# Altium schematic sheet SSRT Tronics.SchDoc
size A4; Organization: Altium Limited; Address1: L3, 12a Rodborough Rd; Address2: Frenchs Forest; Address3: NSW; Address4: Australia 2086; SheetNumber: 1; SheetTotal: 2
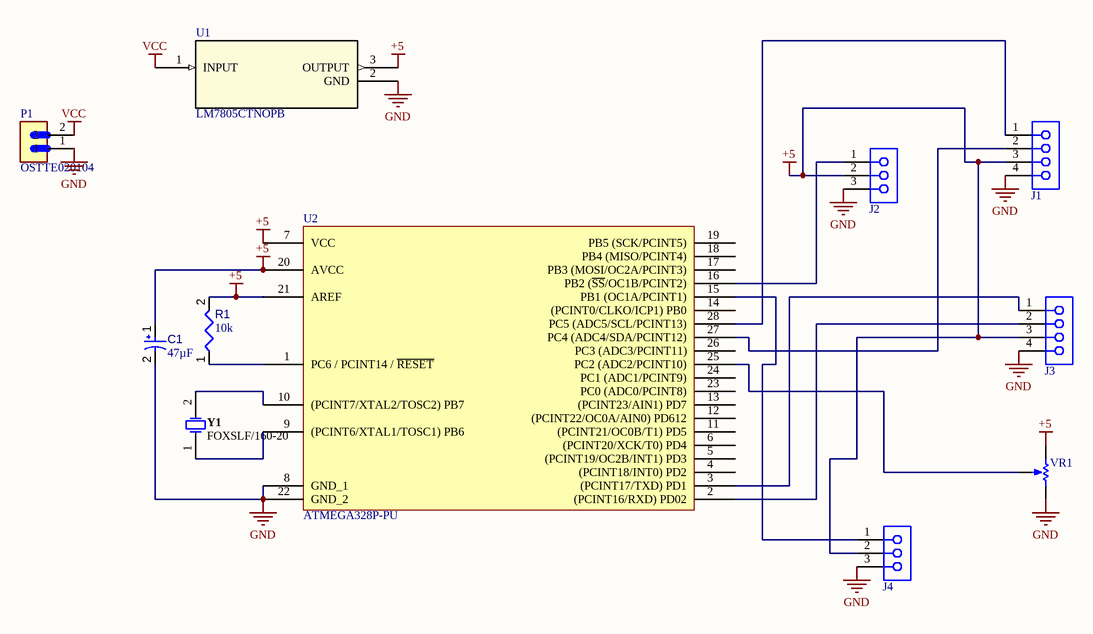
[diagram p0: SSRT Tronics.SchDoc]

## Parts
C1  value 47µF  [CAPPR55-250-1120X630X1220]  (hidden comment: ECA-1HM470)
J1  61300411821  [61300411821]  (value not drawn)
J2  61300311821  [61300311821]  (value not drawn)
J3  61300411821  [61300411821]  (value not drawn)
J4  61300311821  [61300311821]  (value not drawn)
P1  OSTTE020104  [OST_OSTTE020104]
R1  value 10k  [RESA60-630X240]  (hidden comment: MFR-25FBF52-10K)
U1  LM7805CTNOPB  [NDE3_TEX]
U2  ATMEGA328P-PU  [27_DIP_7.62mm]
VR1  3296W-1-103LF  [BOUR-3296W]  (value not drawn)
Y1  FOXSLF/160-20  [FOX-FOXSLF160-20]

## Nets
+5: C1.1 J1.3 J2.2 J3.3 J4.2 R1.2 U1.3(OUTPUT) U2.7(VCC) U2.20(AVCC) U2.21(AREF) VR1.1(CCW)
GND: C1.2 J1.4 J2.3 J3.4 J4.3 P1.1 U1.2(GND) U2.8(GND_1) U2.22(GND_2) VR1.3(CW)
VCC: P1.2 U1.1(INPUT)
NetJ1_1: J1.1 U2.28(PC5_(ADC5/SCL/PCINT13))
NetJ1_2: J1.2 U2.27(PC4_(ADC4/SDA/PCINT12))
NetJ2_1: J2.1 U2.16(PB2_(~{SS}/OC1B/PCINT2))
NetJ3_1: J3.1 U2.3((PCINT17/TXD)_PD1)
NetJ3_2: J3.2 U2.2((PCINT16/RXD)_PD02)
NetJ4_1: J4.1 U2.15(PB1_(OC1A/PCINT1))
NetR1_1: R1.1 U2.1(PC6_/_PCINT14_/_~{RESET})
NetU2_9: U2.9((PCINT6/XTAL1/TOSC1)_PB6) Y1.1
NetU2_10: U2.10((PCINT7/XTAL2/TOSC2)_PB7) Y1.2
NetU2_25: U2.25(PC2_(ADC2/PCINT10)) VR1.2(S)

Not connected (* = marked no-connect by the designer): U2 4((PCINT18/INT0)_PD2) 5((PCINT19/OC2B/INT1)_PD3) 6((PCINT20/XCK/T0)_PD4) 11((PCINT21/OC0B/T1)_PD5) 12((PCINT22/OC0A/AIN0)_PD612) 13((PCINT23/AIN1)_PD7) 14((PCINT0/CLKO/ICP1)_PB0) 17(PB3_(MOSI/OC2A/PCINT3)) 18(PB4_(MISO/PCINT4)) 19(PB5_(SCK/PCINT5)) 23(PC0_(ADC0/PCINT8)) 24(PC1_(ADC1/PCINT9)) 26(PC3_(ADC3/PCINT11))

## Notes on the sheet
- Title
- Size:
- Date:
- A4
- Number:
- Time:
- Revision:
- Sheet
- of
- File:

## Library data of the parts
C1 = CMP-001-00031-7: Aluminum Electrolytic Capacitor, 47 uF, +/-20%, 50 V, -40 to 85 degC, 2-Pin THD, RoHS, Bulk; Manufacturer: Panasonic; Ripple Current: 130mA; Voltage Rating: 50V; Tolerance: 20%; RoHS Compliant: True; Lead Pitch: 2.5mm; Packaging: Bulk; Case/Package: Radial; Diameter: 6.3mm; Datasheet Version: Apr-16; Mounting Technology: TH; Max Operating Temperature: 85°C; Package Quantity: 200; Package Description: 2-Pin Radial Lead, Dia 6.3 mm, Height 12.2 mm; Capacitor Type: Electrolytic; Min Operating Temperature: -40°C; Ripple Current (AC): 130mA; Manufacturer URL: http://www.panasonic.com/; Pins: 2; Datasheet URL: https://industrial.panasonic.com/cdbs/www-data/pdf/RDF0000/DMF0000COL72.pdf; Package Reference: CAPPR55-250-1120X630X1220
J1 J3 = 61300411821: WR-PHD Socket Header, THT, Vertical, pitch 2.54mm, 1 Row, 4P; Manufacturer: Wurth Elektronik; Contact Resistance: 20mOhm; Rated Current: 3A; Working Voltage: 250V; Withstanding Voltage: 500V; Manufacturer Part Number: 61300411821; Category: Board-to-Board Connectors; Match Code: WR-PHD; ComponentLink1Description: Website Link; ComponentLink1URL: https://www.we-online.com/redexpert/article/61300411821?ad; ComponentLink2Description: Datasheet Link; ComponentLink2URL: https://www.we-online.com/redexpert/spec/61300411821?ad; Mount: Through Hole; Operating Temperature Max: 125°C; Operating Temperature Min: -40°C; Packaging: Tray; Gender: Socket Header; Number of Pins: 4; Number of Rows: 1; Orientation: Vertical; Pitch: 2.54mm
J2 J4 = 61300311821: WR-PHD Socket Header, THT, Vertical, pitch 2.54mm, 1 Row, 3P; Manufacturer: Wurth Elektronik; Contact Resistance: 20mOhm; Rated Current: 3A; Working Voltage: 250V; Withstanding Voltage: 500V; Manufacturer Part Number: 61300311821; Category: Board-to-Board Connectors; Match Code: WR-PHD; ComponentLink1Description: Website Link; ComponentLink1URL: https://www.we-online.com/redexpert/article/61300311821?ad; ComponentLink2Description: Datasheet Link; ComponentLink2URL: https://www.we-online.com/redexpert/spec/61300311821?ad; Mount: Through Hole; Operating Temperature Max: 125°C; Operating Temperature Min: -40°C; Packaging: Tray; Gender: Socket Header; Number of Pins: 3; Number of Rows: 1; Orientation: Vertical; Pitch: 2.54mm
P1 = OSTTE020104: 2 Position Wire to Board Terminal Block Horizontal with Board 0.138 (3.50mm) Through Hole; MF: On Shore; SnapEDA_Link: https://www.snapeda.com/parts/OSTTE020104/ON/view-part/?ref=snap; Package: None; Value: *; MP: OSTTE020104; Check_prices: https://www.snapeda.com/parts/OSTTE020104/ON/view-part/?ref=eda
R1 = CMP-009-00047-4: Axial Resistor, 10 KOhm, +/- 1%, 0.25 W, -55 to 155 degC, 2-Pin THD, RoHS, Bulk; Manufacturer: Yageo; Power: 250mW; Voltage Rating: 250V; Manufacturer URL: http://www.yageo.com/; Datasheet URL: http://www.yageo.com/documents/recent/Yageo%20LR_MFR_2013.pdf; Package Reference: MFR-25; Min Operating Temperature: -55°C; Mounting Technology: TH; Package Quantity: 200; Case/Package: Axial; Tolerance: 1%; RoHS Compliant: True; Datasheet Version: Apr-13; Packaging: Bulk; Max Operating Temperature: 155°C; Package Description: 2-Pin Axial Lead, Dia 2.4 mm, Body Length 6.3 mm
U1 = LM7805CTNOPB: No Description Available; Mfr_Name: Texas Instruments; RefDes: RefDes; Type: Type
U2 = ATMEGA328P-PU: ATMEGA328P-PU; 8 bit Microcontroller AVR 20MHz 1; 32kb Flash; 2kb RAM; I2C SPI 2; Manufacturer: Microchip / Atmel; Number of PWM Channels: 6; Number of Timers/Counters: 3; Min Supply Voltage: 1.8V; Max Supply Voltage: 5.5V; Interface: I2C,SPI,UART,USART,2-Wire; Number of I/Os: 23; Oscillator Type: Internal; Data Bus Width: 8b; Number of SPI Channels: 1; Watchdog Timer: Yes; Peripherals: Brown-out Detect/Reset,POR,PWM,WDT; Manufacturer Part Number: ATMEGA328P-PU; RoHS: Yes; Category: Microcontrollers; Stock 1: 5280; Pricing 1: 1=2,08000, 25=1,91000, 100=1,73000 (USD); Mount: Through Hole; Case/Package: PDIP; Number of Pins: 28; Contact Plating: Tin,Matte; Min Operating Temperature: -40°C; Max Operating Temperature: 85°C; Package Quantity: 14; Core Architecture: AVR; RAM Size: 2KB; Number of ADC Channels: 6; Packaging: Rail/Tube; Frequency: 20MHz; Number of Programmable I/O: 23; Max Frequency: 20MHz; Number of I2C Channels: 1; Memory Type: FLASH; Memory Size: 32KB; Length: 37.4mm; Height: 3.28mm; Width: 6.76mm; Radiation Hardening: No; REACH SVHC: No SVHC; Lead Free: Lead Free; ComponentLink1URL: https://datasheet.ciiva.com/20168/73-4283-20168380.pdf?src-supplier=Rapid+Electronics; ComponentLink1Description: https://datasheet.ciiva.com/20168/73-4283-20168380.pdf?src-supplier=Rapid+Electronics; ComponentLink2URL: https://datasheet.ciiva.com/19457/2139111-19457070.pdf?src-supplier=Jameco; ComponentLink2Description: https://datasheet.ciiva.com/19457/2139111-19457070.pdf?src-supplier=Jameco; ComponentLink3URL: https://datasheet.ciiva.com/1157/1684409-1157696.pdf?src-supplier=Element14; ComponentLink3Description: https://datasheet.ciiva.com/1157/1684409-1157696.pdf?src-supplier=Element14; ComponentLink4URL: https://datasheet.ciiva.com/26818/atmega328p-pu-26818578.pdf?src-supplier=IIIC; ComponentLink4Description: https://datasheet.ciiva.com/26818/atmega328p-pu-26818578.pdf?src-supplier=IIIC; ComponentLink5URL: https://datasheet.ciiva.com/29119/155197-da-01-en-microcontr-atmega328p-pu-8bit-pdip-28-29119593.pdf?src-supplier=Conrad; ComponentLink5Description: https://datasheet.ciiva.com/29119/155197-da-01-en-microcontr-atmega328p-pu-8bit-pdip-28-29119593.pdf?src-supplier=Conrad; ComponentLink6URL: https://datasheet.ciiva.com/15213/getdatasheetpartid-318533-15213133.pdf?src-supplier=Verical; ComponentLink6Description: https://datasheet.ciiva.com/15213/getdatasheetpartid-318533-15213133.pdf?src-supplier=Verical; Supplier 1: Digi-Key; Supplier Part Number 1: ATMEGA328P-PU-ND
VR1 = CMP-009-00038-2: Square Trimpot(R) Trimming Potentiometer, 10 KOhm, +/- 10%, 0.5 W, -55 to 125 degC, 3-Pin THD, RoHS, Tube; Manufacturer: Bourns; Voltage Rating: 300V; Power: 500mW; Resistance: 10k; Tolerance: 10%; Min Operating Temperature: -55°C; Case/Package: 3296W; Max Operating Temperature: 150°C; Package Reference: 3296W; Mounting Technology: TH; Manufacturer URL: http://www.bourns.com/; Package Quantity: 50; Package Description: 3-Pin Through Hole Device, Body 9.53 x 4.83 mm, Pitch 2.54 mm; Packaging: Rail/Tube; Datasheet URL: http://www.bourns.com/docs/Product-Datasheets/3296.pdf; RoHS Compliant: True; Datasheet Version: May-16
Y1 = CMP-003-00027-2: Resistance Weld Thru-Hole Crystal, 16 MHz, +/- 30 ppm, 20 pF, -20 to 70 degC, 2-Pin THD, RoHS, Bulk; Manufacturer: FOX Electronics; Load Capacitance: 20pF; Resistance: 40Ohm; ESR: 40; Tolerance: 50ppm; Frequency Tolerance: 30ppm; Frequency: 16MHz; Datasheet URL: http://www.foxonline.com/pdfs/hc49slf.pdf; Packaging: Bulk; Min Operating Temperature: -20°C; Max Operating Temperature: 70°C; Mounting Technology: TH; RoHS Compliant: True; Datasheet Version: Mar-15; Manufacturer URL: http://www.foxonline.com/; Package Description: 2-Pin Through Hole Device, Body 11.35 x 4.65 mm; Pins: 2; Package Quantity: 100; Case/Package: FOXSLF160-20; Package Reference: FOXSLF160-20